# Altium schematic sheet SATA.SchDoc
size A; DocumentNumber: 2; SheetNumber: 2; SheetTotal: 8
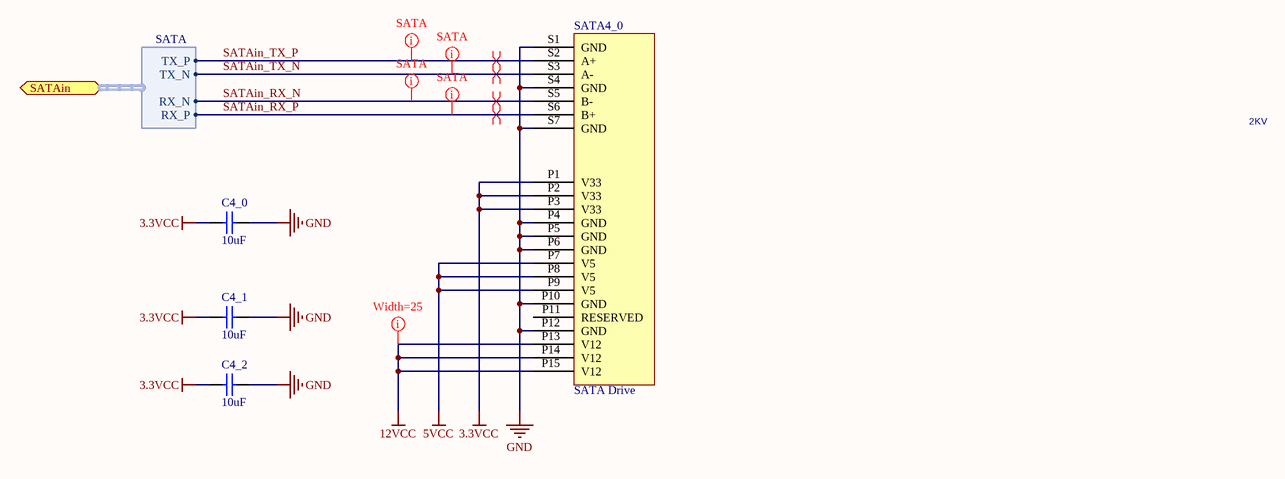
[diagram p0: SATA.SchDoc]

## Parts
C4_0  10uF  [1210 (3225) Capacitor]
C4_1  10uF  [1210 (3225) Capacitor]
C4_2  10uF  [1210 (3225) Capacitor]
SATA4_0  SATA Drive  [SATA HDD]

## Ports
SATAin (harness SATA)

## Harnesses
SATA: TX_P, TX_N, RX_N, RX_P

## Nets
3.3VCC: C4_0.2 C4_1.2 C4_2.2 SATA4_0.P1(V33) SATA4_0.P2(V33) SATA4_0.P3(V33)
5VCC: SATA4_0.P7(V5) SATA4_0.P8(V5) SATA4_0.P9(V5)
12VCC: SATA4_0.P13(V12) SATA4_0.P14(V12) SATA4_0.P15(V12)
GND: C4_0.1 C4_1.1 C4_2.1 SATA4_0.P4(GND) SATA4_0.P5(GND) SATA4_0.P6(GND) SATA4_0.P10(GND) SATA4_0.P12(GND) SATA4_0.S1(GND) SATA4_0.S4(GND) SATA4_0.S7(GND)
SATAin_RX_N: SATA4_0.S5(B-) ; port SATAin.RX_N
SATAin_RX_P: SATA4_0.S6(B+) ; port SATAin.RX_P
SATAin_TX_N: SATA4_0.S3(A-) ; port SATAin.TX_N
SATAin_TX_P: SATA4_0.S2(A+) ; port SATAin.TX_P

Not connected (* = marked no-connect by the designer): SATA4_0 P11(RESERVED)

## Layout directives
differential pair: SATAin_RX_N, SATAin_RX_P, SATAin_TX_N, SATAin_TX_P
rule Width Constraint [Pref Width = 25mil    Min Width = 25mil    Max Width = 100mil]: 12VCC
rule Width Constraint [Pref Width = 6mil    Min Width = 6mil    Max Width = 6mil]; rule Length Constraint [Min Length = 0mil    Max Length = 4500mil]; rule Differential Pairs Routing [Pref Gap = 7mil    Min Gap  = 7mil    Max Gap  = 7mil]; rule Matched Net Lengths [Tolerance = 5mil]: SATAin_RX_N, SATAin_RX_P, SATAin_TX_N, SATAin_TX_P

## Notes on the sheet
- 2KV

## Library data of the parts
C4_0-C4_2 = Capacitor (non-polarized): Capacitor; Value: 10nF; Digikey Part Number: 399-1158-1-ND
SATA4_0 = SATA Drive: SATA HDD, FCI Part# 10029364; Digikey part Number: 609-1028-ND